# Altium project BW1098OBC_R2M0E2.PrjPcb (part 3 of 3)

## Sheet BW1098OBC_LEFT_OV9282.SchDoc: =project_title
size Tabloid; PageSetup: Record=PageOptions|CenterHorizontal=True|CenterVertical=True|PrintScale=0.71|XCorrection=1.00|YCorrection=1.00|PrintKind=0|BorderSize=5000000|LeftOffset=0|BottomOffset=0|Orientation=2|PaperLength=1000|PaperWidth=1000|Scale=100|PaperSource=7|PrintQuality=-4|MediaType=1|DitherType=10|PrintScaleMode=1|PaperKind=A4; CompanyName: Luxonis Holding; DrawnBy: Brian Weinstein; Organization: Luxonis Holding; Address1: 1925 Harmony Park Drive; Address2: Westminster, CO; Address3: 80234; Address4: United States; DocumentNumber: DXXXX; Revision: R2M0E2; SheetNumber: 4; SheetTotal: 8
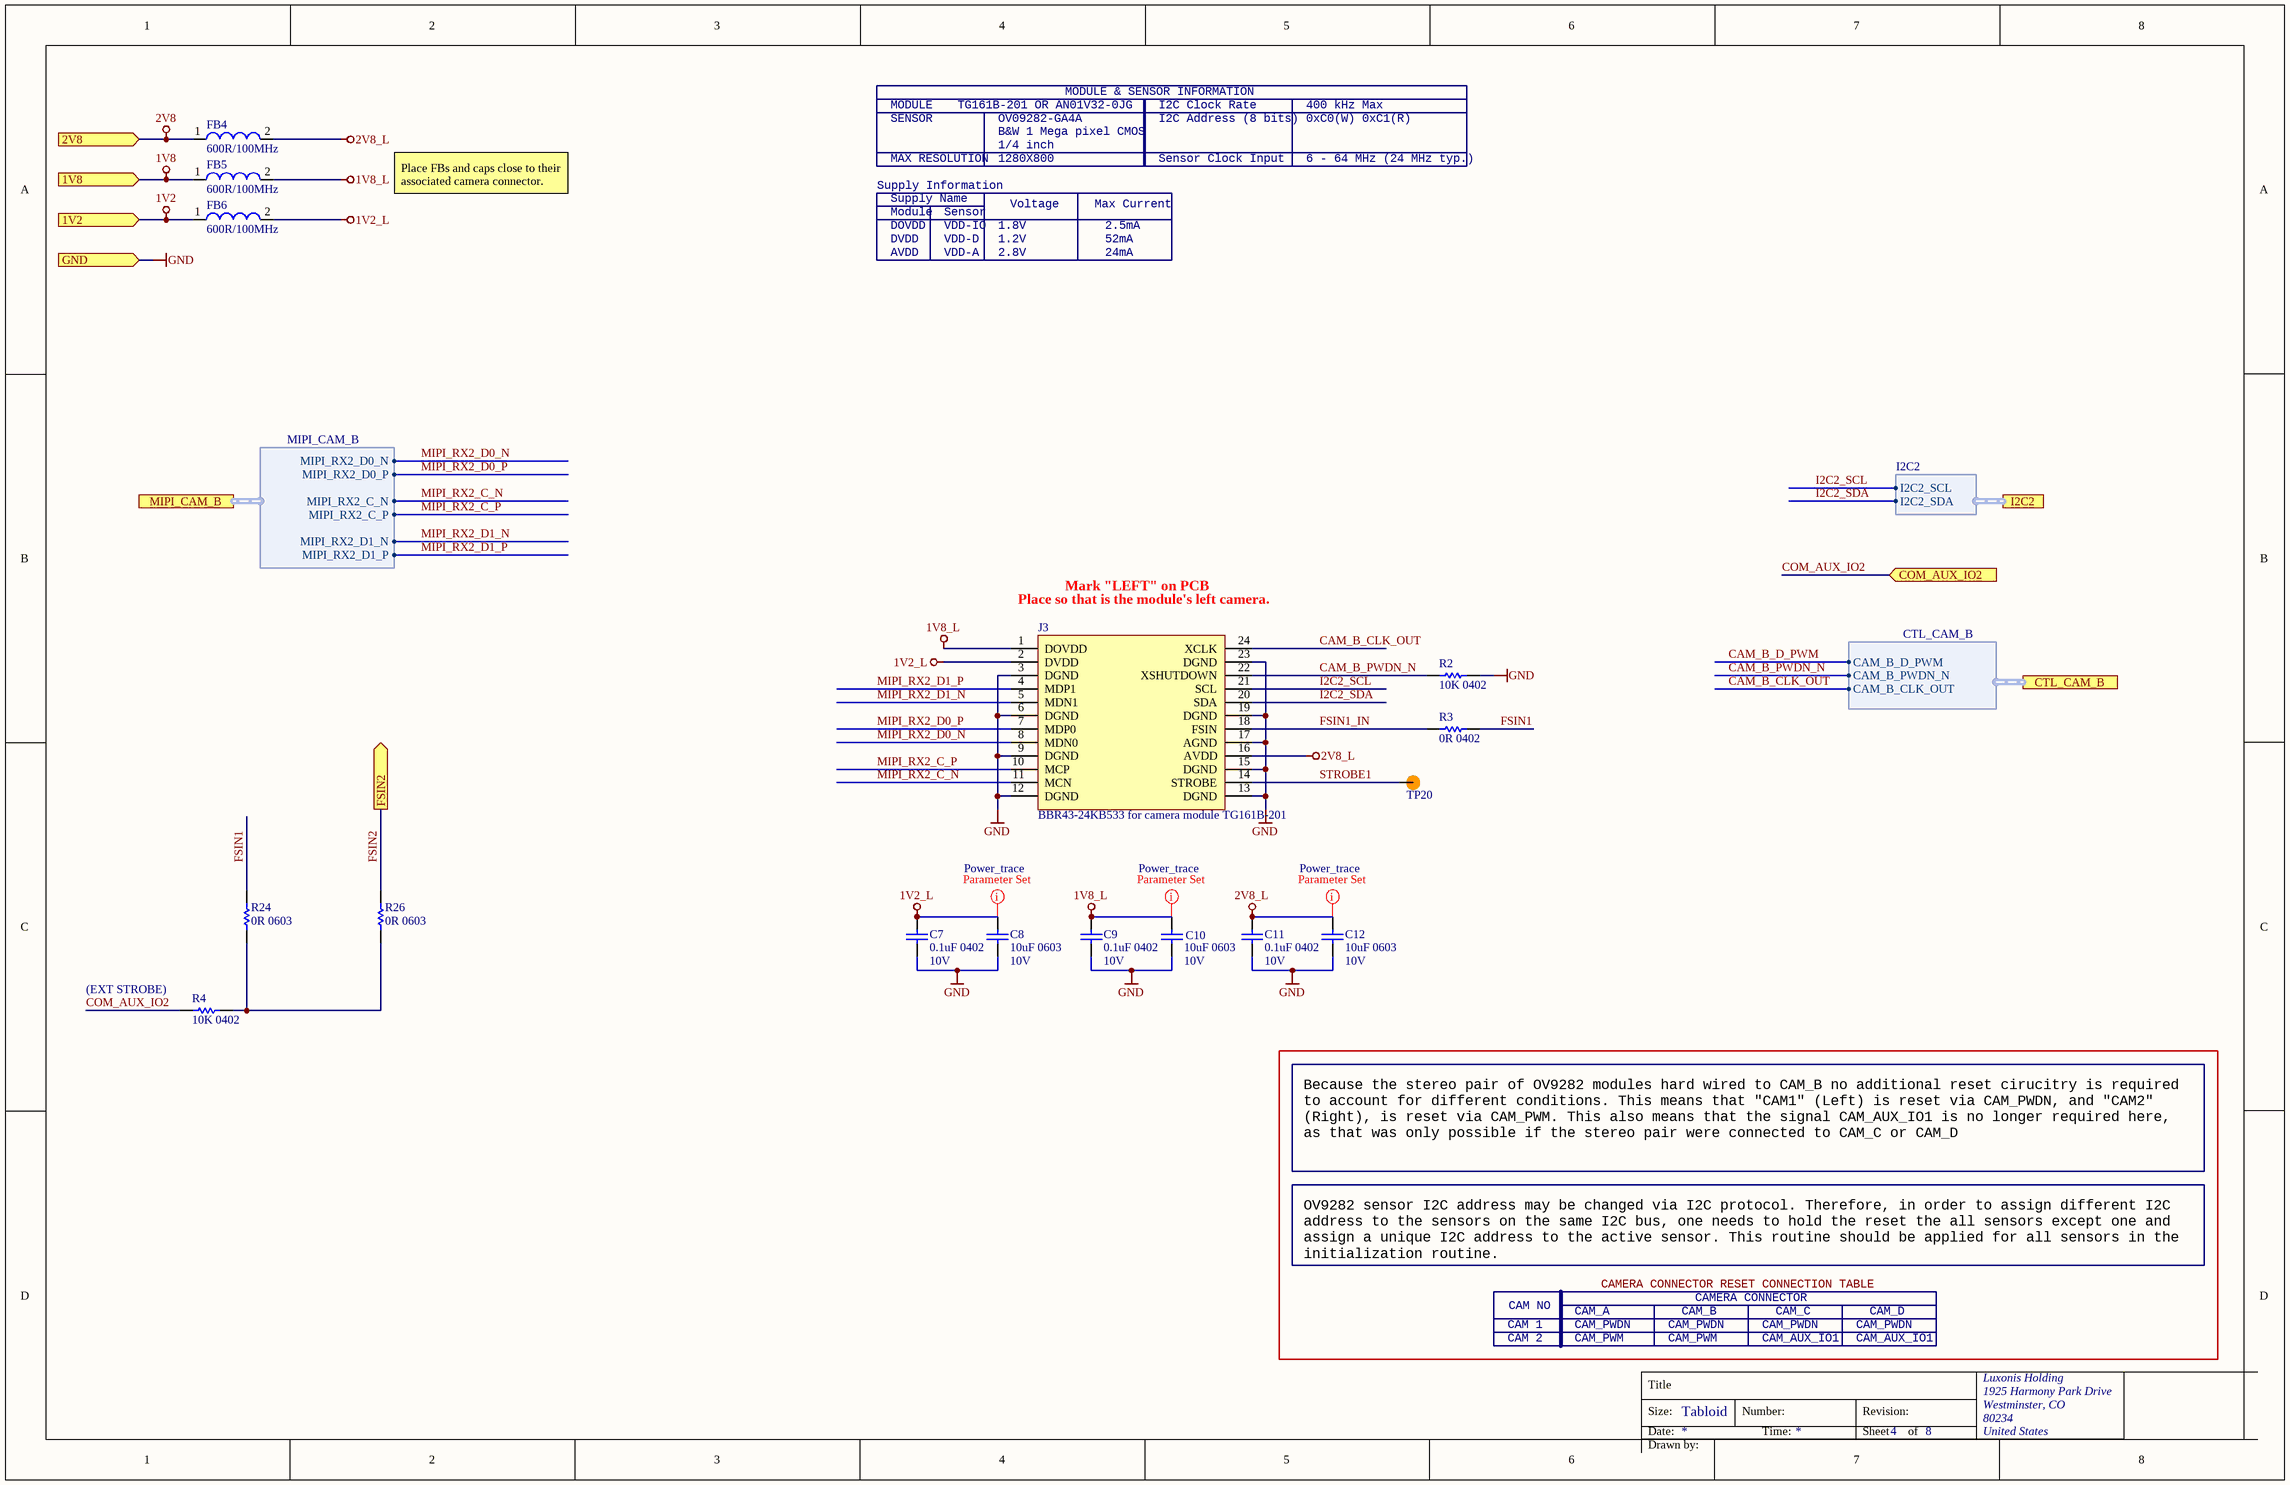
[diagram p5: BW1098OBC_LEFT_OV9282.SchDoc]

### Parts
C7  0.1uF 0402  Voltage Rating: 10V  [CAPC0402(1005)70_L]
C8  10uF 0603  Voltage Rating: 10V  [CAPC0603(1608)100_L]
C9  0.1uF 0402  Voltage Rating: 10V  [CAPC0402(1005)70_L]
C10  10uF 0603  Voltage Rating: 10V  [CAPC0603(1608)100_L]
C11  0.1uF 0402  Voltage Rating: 10V  [CAPC0402(1005)70_L]
C12  10uF 0603  Voltage Rating: 10V  [CAPC0603(1608)100_L]
FB4  600R/100MHz  [2508056017Y2]
FB5  600R/100MHz  [2508056017Y2]
FB6  600R/100MHz  [2508056017Y2]
J3  BBR43-24KB533 for camera module TG161B-201  [TG161B-201 / AN01V32 - Board Wrap (7mm setback) MinPads]
R2  10K 0402  [RESC0402(1005)_L]
R3  0R 0402  [RESC0402(1005)_L]
R4  10K 0402  [RESC0402(1005)_L]
R24  0R 0603  [RESC0603(1608)_N]
R26  0R 0603  [RESC0603(1608)_N]
TP20  TP100_200_NS  [TP100_200_NS]  (value not drawn)  (no BOM)

### Ports
1V2 (in), 1V8 (in), 2V8 (in), COM_AUX_IO2 (in), CTL_CAM_B (harness CTL_CAM_B), FSIN2 (out), GND (in), I2C2 (harness I2C2), MIPI_CAM_B (harness MIPI_CAM_B)

### Harnesses
I2C2: I2C2_SDA, I2C2_SCL
MIPI_CAM_B: MIPI_RX2_D1_P, MIPI_RX2_D1_N, MIPI_RX2_D0_N, MIPI_RX2_D0_P, MIPI_RX2_C_N, MIPI_RX2_C_P
CTL_CAM_B: CAM_B_CLK_OUT, CAM_B_PWDN_N, CAM_B_D_PWM

### Nets
1V2: FB6.1 ; port 1V2
1V2_L: C7.2 C8.2 FB6.2 J3.2(DVDD)
1V8: FB5.1 ; port 1V8
1V8_L: C9.2 C10.2 FB5.2 J3.1(DOVDD)
2V8: FB4.1 ; port 2V8
2V8_L: C11.2 C12.2 FB4.2 J3.16(AVDD)
GND: C7.1 C8.1 C9.1 C10.1 C11.1 C12.1 J3.3(DGND) J3.6(DGND) J3.9(DGND) J3.12(DGND) J3.13(DGND) J3.15(DGND) J3.17(AGND) J3.19(DGND) J3.23(DGND) R2.2 ; port GND
CAM_B_CLK_OUT: J3.24(XCLK) ; port CTL_CAM_B.CAM_B_CLK_OUT
CAM_B_PWDN_N: J3.22(XSHUTDOWN) R2.1 ; port CTL_CAM_B.CAM_B_PWDN_N
COM_AUX_IO2: R4.1 ; port COM_AUX_IO2
FSIN1: R3.2 R24.2
FSIN1_IN: J3.18(FSIN) R3.1
FSIN2: R26.2 ; port FSIN2
I2C2_SCL: J3.21(SCL) ; port I2C2.I2C2_SCL
I2C2_SDA: J3.20(SDA) ; port I2C2.I2C2_SDA
MIPI_RX2_C_N: J3.11(MCN) ; port MIPI_CAM_B.MIPI_RX2_C_N
MIPI_RX2_C_P: J3.10(MCP) ; port MIPI_CAM_B.MIPI_RX2_C_P
MIPI_RX2_D0_N: J3.8(MDN0) ; port MIPI_CAM_B.MIPI_RX2_D0_N
MIPI_RX2_D0_P: J3.7(MDP0) ; port MIPI_CAM_B.MIPI_RX2_D0_P
MIPI_RX2_D1_N: J3.5(MDN1) ; port MIPI_CAM_B.MIPI_RX2_D1_N
MIPI_RX2_D1_P: J3.4(MDP1) ; port MIPI_CAM_B.MIPI_RX2_D1_P
STROBE1: J3.14(STROBE) TP20.1
NetR4_2: R4.2 R24.1 R26.1

### Layout directives
net class Power_trace: 1V2_L, 1V8_L, 2V8_L

### Notes on the sheet
- MODULE & SENSOR INFORMATION
- SENSOR
- MODULE
- MAX RESOLUTION
- TG161B-201 OR AN01V32-0JG
- B&W 1 Mega pixel CMOS
- 1280X800
- OV09282-GA4A
- 1/4 inch
- I2C Address (8 bits)
- I2C Clock Rate
- Sensor Clock Input
- 400 kHz Max
- 6 - 64 MHz (24 MHz typ.)
- 0xC0(W) 0xC1(R)
- Place FBs and caps close to their associated camera connector.
- Supply Information
- DOVDD
- Supply Name
- Module
- VDD-IO
- Sensor
- 1.8V
- Voltage
- Max Current
- 2.5mA
- AVDD
- DVDD
- VDD-A
- VDD-D
- 2.8V
- 1.2V
- 24mA
- 52mA
- (near J3) Place so that is the module's left camera.
- Mark "LEFT" on PCB
- (near R4) (EXT STROBE)
- Because the stereo pair of OV9282 modules hard wired to CAM_B no additional reset cirucitry is required to account for different conditions. This means that "CAM1" (Left) is reset via CAM_PWDN, and "CAM2" (Right), is reset via CAM_PWM. This also means that the signal CAM_AUX_IO1 is no longer required here, as that was only possible if the stereo pair were connected to CAM_C or CAM_D
- OV9282 sensor I2C address may be changed via I2C protocol. Therefore, in order to assign different I2C address to the sensors on the same I2C bus, one needs to hold the reset the all sensors except one and assign a unique I2C address to the active sensor. This routine should be applied for all sensors in the initialization routine.
- CAMERA CONNECTOR RESET CONNECTION TABLE
- CAMERA CONNECTOR
- CAM 1
- CAM 2
- CAM NO
- CAM_A
- CAM_PWDN
- CAM_PWM
- CAM_B
- CAM_AUX_IO1
- CAM_C
- CAM_D
- Title
- Size:
- Date:
- Tabloid
- Number:
- Time:
- Revision:
- Sheet
- of
- Drawn by:

### Library data of the parts
C7 C9 C11 = GRM155R71A104JA01D: CAP CER 0.1UF 10V X7R 0402 5%; Manufacturer 1: Murata; Capacitance: 100nF; Supplier 1: Digi-Key; Manufacturer Part Number 1: GRM155R71A104JA01D; Stock 1: 1346709; Pricing 1: 1=0.10000, 10=0.02500, 100=0.01130, 500=0.00806, 1000=0.00633, 2500=0.00575, 5000=0.00529 (USD); RoHS: Yes; Mount: Surface Mount; Case/Package: 0402; Case Code (Imperial): 0402; Case Code (Metric): 1005; Min Operating Temperature: -55°C; Max Operating Temperature: 125°C; Tolerance: 5%; Packaging: Tape and Reel; Voltage Rating (DC): 10V; Dielectric: X7R; Package Quantity: 10000; Termination: SMD/SMT; Length: 1mm; Height: 0.5mm; Width: 0.02inch; Thickness: 0.022inch; Depth: 0.5mm; Radiation Hardening: No; Lead Free: Lead Free; ComponentLink1URL: https://datasheet.ciiva.com/5411/product-5411135.pdf?src-supplier=Mouser; ComponentLink1Description: https://datasheet.ciiva.com/5411/product-5411135.pdf?src-supplier=Mouser; ComponentLink2URL: https://datasheet.ciiva.com/11618/c02e-11618821.pdf?src-supplier=Avnet; ComponentLink2Description: https://datasheet.ciiva.com/11618/c02e-11618821.pdf?src-supplier=Avnet; Supplier Part Number 1: 490-10777-1-ND
C8 C10 C12 = GRM188R61A106ME69D: CAP CER 10UF 10V X5R 0603 20%; Manufacturer 1: Murata; Material: Ceramic; Supplier 1: Digi-Key; Manufacturer Part Number 1: GRM188R61A106ME69D; Stock 1: 2873098; Pricing 1: 1=0.21000, 10=0.14100, 100=0.07130, 500=0.04876, 1000=0.04313 (USD); RoHS: Yes; Mount: Surface Mount; Case/Package: 0603; Weight: 0.000222oz; Case Code (Metric): 1608; Case Code (Imperial): 0603; Min Operating Temperature: -55°C; Max Operating Temperature: 85°C; Packaging: Tape and Reel; Tolerance: 20%; Capacitance: 10uF; Dielectric: X5R; Voltage Rating (DC): 10V; Package Quantity: 4000; Termination: SMD/SMT; Length: 1.6mm; Height: 0.8mm; Width: 0.8mm; Thickness: 0.035inch; Depth: 0.8mm; REACH SVHC: Unknown; Lead Free: Lead Free; ComponentLink1URL: http://www.mouser.com/ds/2/281/c02e-2905.pdf?src-supplier=Mouser; ComponentLink1Description: http://www.mouser.com/ds/2/281/c02e-2905.pdf?src-supplier=Mouser; ComponentLink2URL: http://components.arrow.com/part/dataview/0323_06119472?src-supplier=Arrow+Europe; ComponentLink2Description: http://components.arrow.com/part/dataview/0323_06119472?src-supplier=Arrow+Europe; ComponentLink3URL: http://www.farnell.com/datasheets/2048014.pdf?src-supplier=Farnell; ComponentLink3Description: http://www.farnell.com/datasheets/2048014.pdf?src-supplier=Farnell; ComponentLink4URL: http://www.farnell.com/datasheets/1872210.pdf?src-supplier=Farnell; ComponentLink4Description: http://www.farnell.com/datasheets/1872210.pdf?src-supplier=Farnell; ComponentLink5URL: http://search.murata.co.jp/Ceramy/image/img/A01X/G101/ENG/GRM188R61A106ME69-01.pdf?src-supplier=Digi-Key; ComponentLink5Description: http://search.murata.co.jp/Ceramy/image/img/A01X/G101/ENG/GRM188R61A106ME69-01.pdf?src-supplier=Digi-Key; ComponentLink6URL: http://www.farnell.com/datasheets/1872210.pdf?src-supplier=Newark; ComponentLink6Description: http://www.farnell.com/datasheets/1872210.pdf?src-supplier=Newark; ComponentLink7URL: http://www.farnell.com/datasheets/2048014.pdf?src-supplier=Element14; ComponentLink7Description: http://www.farnell.com/datasheets/2048014.pdf?src-supplier=Element14; ComponentLink8URL: http://www.farnell.com/datasheets/2048014.pdf?src-supplier=Newark; ComponentLink8Description: http://www.farnell.com/datasheets/2048014.pdf?src-supplier=Newark; Supplier Part Number 1: 490-10475-1-ND
FB4-FB6 = 2508056017Y2: FERRITE BEAD, 0.1OHM, 2A, 0805, 600R/100MHz; Manufacturer 1: Fair-Rite; Impedance: 600R; Tolerance: 25%; Resistance: 350mR; DC Resistance (DCR): 100mR; Test Frequency: 100MHz; Supplier 1: Digi-Key; Manufacturer Part Number 1: 2508056017Y2; Stock 1: 100491; Pricing 1: 1=0.10000, 10=0.07900, 25=0.07120, 50=0.05240, 100=0.04520, 250=0.03568, 500=0.03014, 1000=0.02538 (USD); RoHS: Yes; Case/Package: 0805; Number of Pins: 2; Case Code (Metric): 2012; Case Code (Imperial): 0805; Min Operating Temperature: -55°C; Max Operating Temperature: 125°C; Package Quantity: 4000; Packaging: Tape and Reel; Max DC Current: 2A; Termination: SMD/SMT; Military Standard: Not; DC Current: 2A; Current Rating: 2A; Frequency: 100MHz; Length: 2mm; Height: 0.9mm; Width: 1.25mm; Depth: 1.25mm; Radiation Hardening: No; REACH SVHC: No SVHC; ComponentLink1URL: https://datasheet.ciiva.com/3854/3802508056017y2-3854245.pdf?src-supplier=Arrow; ComponentLink1Description: https://datasheet.ciiva.com/3854/3802508056017y2-3854245.pdf?src-supplier=Arrow; ComponentLink2URL: https://datasheet.ciiva.com/22735/652149-22735047.pdf?src-supplier=Element14; ComponentLink2Description: https://datasheet.ciiva.com/22735/652149-22735047.pdf?src-supplier=Element14; ComponentLink3URL: https://datasheet.ciiva.com/1127/26143-1127514.pdf?src-supplier=Farnell; ComponentLink3Description: https://datasheet.ciiva.com/1127/26143-1127514.pdf?src-supplier=Farnell; ComponentLink4URL: https://datasheet.ciiva.com/18090/getdatasheetpartid-212640-18090187.pdf?src-supplier=Verical; ComponentLink4Description: https://datasheet.ciiva.com/18090/getdatasheetpartid-212640-18090187.pdf?src-supplier=Verical; ComponentLink5URL: https://datasheet.ciiva.com/7620/26143-7620140.pdf?src-supplier=Element14; ComponentLink5Description: https://datasheet.ciiva.com/7620/26143-7620140.pdf?src-supplier=Element14; Supplier Part Number 1: 1934-1487-1-ND
J3 = TG161B-201_Connector: CONN 24 way, 2 row board to board connector SMD; Manufacturer: ACON; Manufacturer PN: BBR43-24KB533
R2 R4 = RC0402FR-1310KL: RES SMD 10K OHM 1% 0402 1/16W Chip Resistor, 0402 [1005 Metric], 10 kohm, RC Series, 50 V, Thick Film, 62.5 mW; Manufacturer 1: Yageo; Resistance: 10kR; Temperature Coefficient: 100ppm/°C; Power Rating: 62.5mW; Voltage Rating: 50V; ComponentLink1URL: https://datasheet.ciiva.com/16940/pyu-rc0402-51-rohs-l-6-16940293.pdf?src-supplier=Avnet+Europe; ComponentLink1Description: https://datasheet.ciiva.com/16940/pyu-rc0402-51-rohs-l-6-16940293.pdf?src-supplier=Avnet+Europe; ComponentLink2URL: https://datasheet.ciiva.com/28386/pyu-rc0402-51-rohs-l-6-28386855.pdf?src-supplier=Avnet+Europe; ComponentLink2Description: https://datasheet.ciiva.com/28386/pyu-rc0402-51-rohs-l-6-28386855.pdf?src-supplier=Avnet+Europe; ComponentLink3URL: https://datasheet.ciiva.com/16740/pyu-rc0402-51-rohs-l-6-r-16740602.pdf?src-supplier=Future+Electronics; ComponentLink3Description: https://datasheet.ciiva.com/16740/pyu-rc0402-51-rohs-l-6-r-16740602.pdf?src-supplier=Future+Electronics; ComponentLink4URL: https://datasheet.ciiva.com/8891/pyu-rc0402-51-rohs-l-6-8891339.pdf?src-supplier=Avnet; ComponentLink4Description: https://datasheet.ciiva.com/8891/pyu-rc0402-51-rohs-l-6-8891339.pdf?src-supplier=Avnet; ComponentLink5URL: https://datasheet.ciiva.com/5557/pyu-rc0402-51-rohs-l-6-r-5557997.pdf?src-supplier=Mouser; ComponentLink5Description: https://datasheet.ciiva.com/5557/pyu-rc0402-51-rohs-l-6-r-5557997.pdf?src-supplier=Mouser; ComponentLink6URL: https://datasheet.ciiva.com/7983/1018594-7983533.pdf?src-supplier=Element14; ComponentLink6Description: https://datasheet.ciiva.com/7983/1018594-7983533.pdf?src-supplier=Element14; Supplier 1: Newark; Manufacturer Part Number 1: RC0402FR-1310KL; Stock 1: 62239; Pricing 1: 1=0.10000, 25=0.01200, 100=0.00400, 250=0.00400, 500=0.00300, 1000=0.00300 (USD); RoHS: Yes; Case/Package: 0402; Number of Pins: 2; Contact Plating: Tin,Matte,Lead; Case Code (Imperial): 0402; Case Code (Metric): 1005; Min Operating Temperature: -55°C; Max Operating Temperature: 155°C; Tolerance: 1%; Composition: Thick Film; Packaging: Tape and Reel; Termination: SMD/SMT; Military Standard: Not; Voltage Rating (DC): 50V; Working Voltage: 50V; Number of Terminations: 2; Length: 1mm; Depth: 0.5mm; Radiation Hardening: No; REACH SVHC: No SVHC; Lead Free: Lead Free; Supplier Part Number 1: 67R9960
R3 = CRCW04020000Z0ED: RES SMD 0 OHM JUMPER 1/16W 0402; Manufacturer 1: Vishay; Resistance: 0mR; Power Rating: 63mW; Voltage Rating: 50V; Temperature Coefficient: 100ppm/°C; Tolerance: 5%; Supplier 1: Digi-Key; Manufacturer Part Number 1: CRCW04020000Z0ED; Stock 1: 855968; Pricing 1: 1=0.10000, 10=0.03400, 25=0.02440, 50=0.01860, 100=0.01380, 250=0.01048, 500=0.00840, 1000=0.00618, 5000=0.00443 (USD); RoHS: Yes; Mount: Surface Mount; Case/Package: 0402; Weight: 2.3E-05oz; Case Code (Imperial): 0402; Case Code (Metric): 1005; Contact Plating: Tin; Min Operating Temperature: -55°C; Max Operating Temperature: 155°C; Packaging: Tape and Reel; Composition: Thick Film; Voltage Rating (DC): 50V; Package Quantity: 1; Termination: SMD/SMT; Number of Terminations: 2; Military Standard: Not; Max Power Dissipation: 63mW; Features: Automotive AEC-Q200; Length: 1mm; Height: 0.35mm; Width: 0.5mm; Depth: 0.5mm; Radiation Hardening: No; REACH SVHC: Unknown; Lead Free: Lead Free; ComponentLink1URL: https://datasheet.ciiva.com/3255/dcrcwe3-3255944.pdf?src-supplier=Avnet; ComponentLink1Description: https://datasheet.ciiva.com/3255/dcrcwe3-3255944.pdf?src-supplier=Avnet; ComponentLink2URL: https://datasheet.ciiva.com/3255/dcrcwe3-3255945.pdf?src-supplier=Avnet; ComponentLink2Description: https://datasheet.ciiva.com/3255/dcrcwe3-3255945.pdf?src-supplier=Avnet; ComponentLink3URL: https://datasheet.ciiva.com/16881/dcrcwe3-16881413.pdf?src-supplier=Avnet+Europe; ComponentLink3Description: https://datasheet.ciiva.com/16881/dcrcwe3-16881413.pdf?src-supplier=Avnet+Europe; ComponentLink4URL: https://datasheet.ciiva.com/2461/dcrcwe3-2461962.pdf?src-supplier=Digi-Key; ComponentLink4Description: https://datasheet.ciiva.com/2461/dcrcwe3-2461962.pdf?src-supplier=Digi-Key; ComponentLink5URL: https://datasheet.ciiva.com/7841/1720486-7841802.pdf?src-supplier=Element14; ComponentLink5Description: https://datasheet.ciiva.com/7841/1720486-7841802.pdf?src-supplier=Element14; ComponentLink6URL: https://datasheet.ciiva.com/2461/dcrcwe3-2461963.pdf?src-supplier=Digi-Key; ComponentLink6Description: https://datasheet.ciiva.com/2461/dcrcwe3-2461963.pdf?src-supplier=Digi-Key; ComponentLink7URL: https://datasheet.ciiva.com/2461/dcrcwe3-2461964.pdf?src-supplier=Digi-Key; ComponentLink7Description: https://datasheet.ciiva.com/2461/dcrcwe3-2461964.pdf?src-supplier=Digi-Key; ComponentLink8URL: https://datasheet.ciiva.com/7841/1697337-7841468.pdf?src-supplier=Element14; ComponentLink8Description: https://datasheet.ciiva.com/7841/1697337-7841468.pdf?src-supplier=Element14; ComponentLink9URL: https://datasheet.ciiva.com/16761/70200976-16761309.pdf?src-supplier=Allied+Electronics; ComponentLink9Description: https://datasheet.ciiva.com/16761/70200976-16761309.pdf?src-supplier=Allied+Electronics; ComponentLink10URL: https://datasheet.ciiva.com/26311/fld-crcw-e3-data-en-26311550.pdf?src-supplier=Distrelec; ComponentLink10Description: https://datasheet.ciiva.com/26311/fld-crcw-e3-data-en-26311550.pdf?src-supplier=Distrelec; Supplier Part Number 1: 541-0.0JCT-ND
R24 R26 = CRCW06030000Z0EA: RES SMD 0 OHM JUMPER 1/10W 0603 0 Ohms Jumper 0.1W, 1/10W Chip Resistor 0603 (1608 Metric) Automotive AEC-Q200 Thick Film; Manufacturer 1: Vishay; Manufacturer Part Number 1: CRCW0603-0000Z0EA; Resistance: 0mR; Power Rating: 100mW; Voltage Rating: 75V; Temperature Coefficient: 100ppm/°C; Tolerance: 5%; Current Rating: 2A; Supplier 1: Digi-Key; Stock 1: 742743; Pricing 1: 1=0.100000, 10=0.034000, 25=0.024400, 50=0.018600, 100=0.013800, 250=0.010480, 500=0.008400, 1000=0.006180 (USD); RoHS: Yes; Mount: Surface Mount; Case/Package: 0603; Weight: 7.1E-05oz; Contact Plating: Tin,Lead; Case Code (Metric): 1608; Case Code (Imperial): 0603; Min Operating Temperature: -55°C; Max Operating Temperature: 155°C; Composition: Thick Film; Termination: SMD/SMT; Packaging: Tape and Reel; Package Quantity: 1; Number of Terminations: 2; Military Standard: Not; Max Power Dissipation: 100mW; Voltage Rating (DC): 75V; Features: Automotive AEC-Q200; Working Voltage: 75V; Length: 1.55mm; Height: 0.02inch; Width: 0.033inch; Depth: 0.85mm; Radiation Hardening: No; Lead Free: Lead Free; REACH SVHC: Unknown; ComponentLink1URL: https://datasheet.ciiva.com/2461/dcrcwe3-2461968.pdf?src-supplier=Digi-Key; ComponentLink1Description: https://datasheet.ciiva.com/2461/dcrcwe3-2461968.pdf?src-supplier=Digi-Key; ComponentLink2URL: https://datasheet.ciiva.com/2461/dcrcwe3-2461969.pdf?src-supplier=Digi-Key; ComponentLink2Description: https://datasheet.ciiva.com/2461/dcrcwe3-2461969.pdf?src-supplier=Digi-Key; ComponentLink3URL: https://datasheet.ciiva.com/2461/dcrcwe3-2461970.pdf?src-supplier=Digi-Key; ComponentLink3Description: https://datasheet.ciiva.com/2461/dcrcwe3-2461970.pdf?src-supplier=Digi-Key; ComponentLink4URL: https://datasheet.ciiva.com/8340/dcrcwe3-8340197.pdf?src-supplier=Avnet; ComponentLink4Description: https://datasheet.ciiva.com/8340/dcrcwe3-8340197.pdf?src-supplier=Avnet; ComponentLink5URL: https://datasheet.ciiva.com/16941/dcrcw-16941302.pdf?src-supplier=Avnet+Europe; ComponentLink5Description: https://datasheet.ciiva.com/16941/dcrcw-16941302.pdf?src-supplier=Avnet+Europe; ComponentLink6URL: https://datasheet.ciiva.com/16199/dcrcwe3-16199063.pdf?src-supplier=Future+Electronics; ComponentLink6Description: https://datasheet.ciiva.com/16199/dcrcwe3-16199063.pdf?src-supplier=Future+Electronics; ComponentLink7URL: https://datasheet.ciiva.com/16725/70201119-16725175.pdf?src-supplier=Allied+Electronics; ComponentLink7Description: https://datasheet.ciiva.com/16725/70201119-16725175.pdf?src-supplier=Allied+Electronics; ComponentLink8URL: https://datasheet.ciiva.com/26316/fld-crcw-e3-data-en-26316615.pdf?src-supplier=Distrelec; ComponentLink8Description: https://datasheet.ciiva.com/26316/fld-crcw-e3-data-en-26316615.pdf?src-supplier=Distrelec; ComponentLink9URL: https://datasheet.ciiva.com/5544/dcrcwe3-109170-5544344.pdf?src-supplier=Mouser; ComponentLink9Description: https://datasheet.ciiva.com/5544/dcrcwe3-109170-5544344.pdf?src-supplier=Mouser; ComponentLink10URL: https://datasheet.ciiva.com/7841/1720486-7841816.pdf?src-supplier=Element14; ComponentLink10Description: https://datasheet.ciiva.com/7841/1720486-7841816.pdf?src-supplier=Element14; ComponentLink11URL: https://datasheet.ciiva.com/7841/1720486-7841817.pdf?src-supplier=Element14; ComponentLink11Description: https://datasheet.ciiva.com/7841/1720486-7841817.pdf?src-supplier=Element14; ComponentLink12URL: https://datasheet.ciiva.com/7841/125364-7841818.pdf?src-supplier=Element14; ComponentLink12Description: https://datasheet.ciiva.com/7841/125364-7841818.pdf?src-supplier=Element14; ComponentLink13URL: https://datasheet.ciiva.com/16721/70201119-16721450.pdf?src-supplier=Allied+Electronics; ComponentLink13Description: https://datasheet.ciiva.com/16721/70201119-16721450.pdf?src-supplier=Allied+Electronics; Supplier Part Number 1: 541-0.0GCT-ND
TP20 = TEST_POINT

## Sheet BW1098OBC_USB.SchDoc: =project_title
size Tabloid; PageSetup: Record=PageOptions|CenterHorizontal=True|CenterVertical=True|PrintScale=0.73|XCorrection=1.00|YCorrection=1.00|PrintKind=0|BorderSize=5000000|LeftOffset=0|BottomOffset=0|Orientation=2|PaperLength=1000|PaperWidth=1000|Scale=100|PaperSource=7|PrintQuality=-4|MediaType=1|DitherType=10|PaperKind=A4|PrintScaleMode=1; CompanyName: Luxonis Holding; DrawnBy: Brian Weinstein; Organization: Luxonis Holding; Address1: 1925 Harmony Park Drive; Address2: Westminster, CO; Address3: 80234; Address4: United States; DocumentNumber: DXXXX; Revision: R2M0E2; SheetNumber: 8; SheetTotal: 8
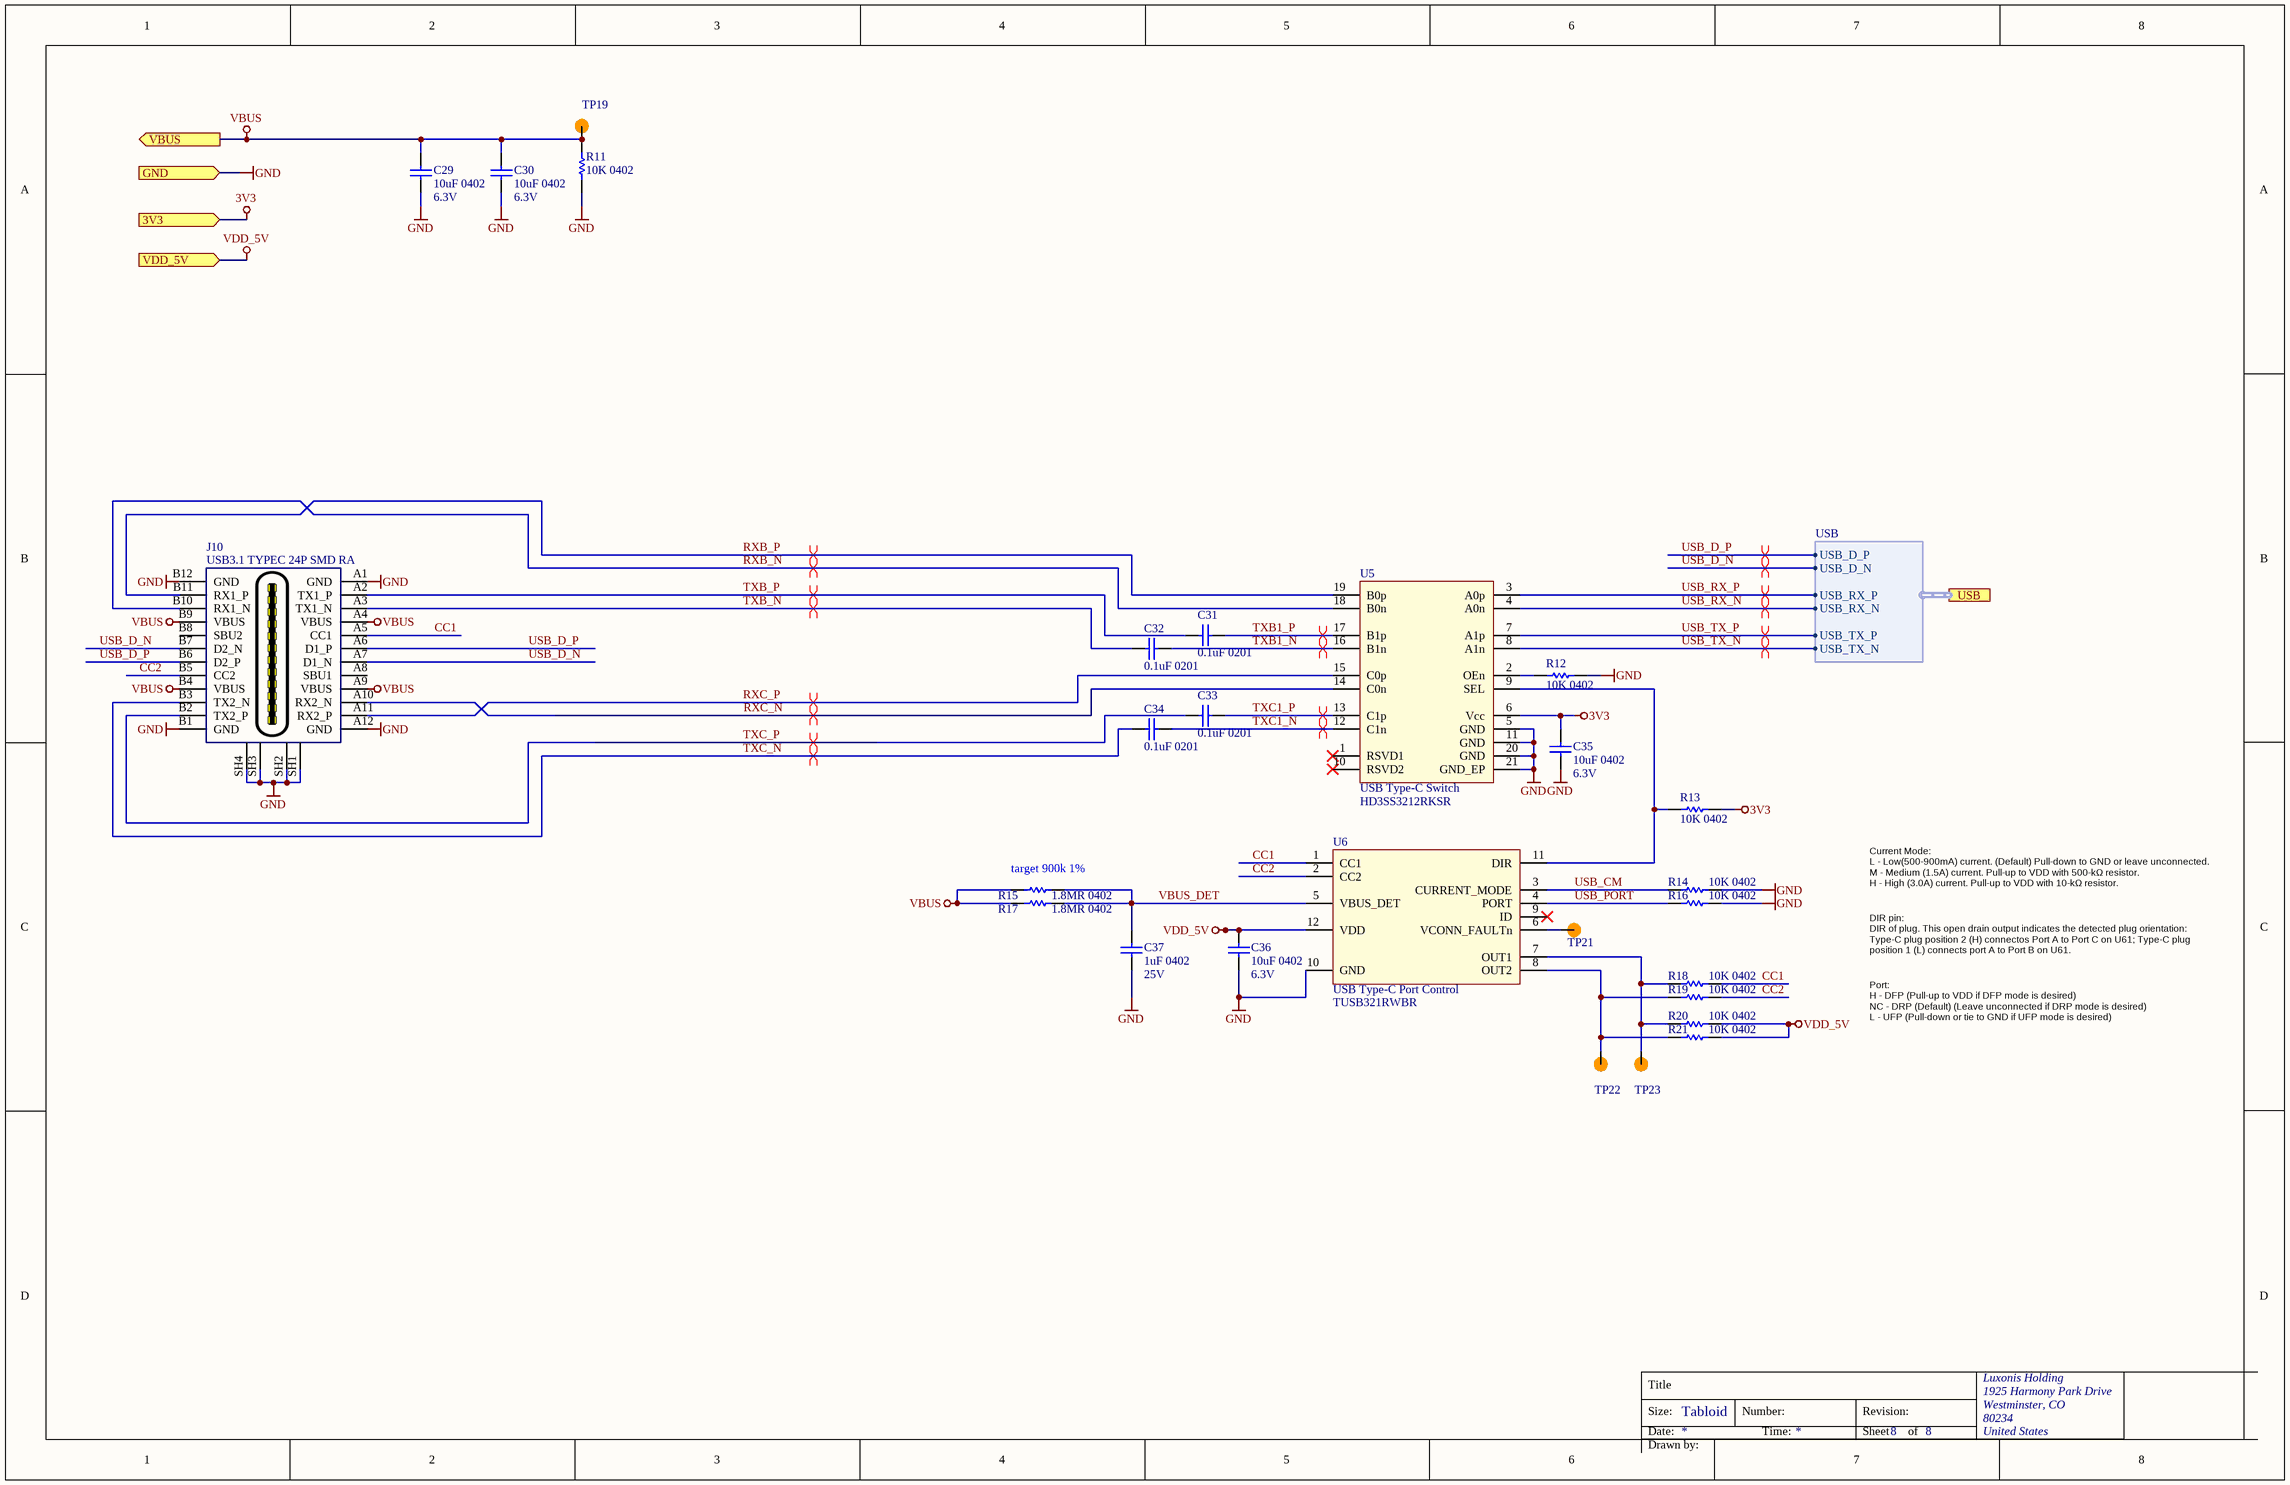
[diagram p6: BW1098OBC_USB.SchDoc]

### Parts
C29  10uF 0402  Voltage Rating: 6.3V  [CAPC0402(1005)70_L]
C30  10uF 0402  Voltage Rating: 6.3V  [CAPC0402(1005)70_L]
C31  0.1uF 0201  [CAPC0201(0603)33_L]
C32  0.1uF 0201  [CAPC0201(0603)33_L]
C33  0.1uF 0201  [CAPC0201(0603)33_L]
C34  0.1uF 0201  [CAPC0201(0603)33_L]
C35  10uF 0402  Voltage Rating: 6.3V  [CAPC0402(1005)70_L]
C36  10uF 0402  Voltage Rating: 6.3V  [CAPC0402(1005)70_L]
C37  1uF 0402  Voltage Rating: 25V  [CAPC0402(1005)70_N]
J10  USB3.1 TYPEC 24P SMD RA  [105450-0101]
R11  10K 0402  [RESC0402(1005)_L]
R12  10K 0402  [RESC0402(1005)_L]
R13  10K 0402  [RESC0402(1005)_L]
R14  10K 0402  [RESC0402(1005)_L]
R15  1.8MR 0402  [RESC0402(1005)_L]
R16  10K 0402  [RESC0402(1005)_L]
R17  1.8MR 0402  [RESC0402(1005)_L]
R18  10K 0402  [RESC0402(1005)_L]
R19  10K 0402  [RESC0402(1005)_L]
R20  10K 0402  [RESC0402(1005)_L]
R21  10K 0402  [RESC0402(1005)_L]
TP19  TP100_200_NS  [TP100_200_NS]  (value not drawn)  (no BOM)
TP21  TP100_200_NS  [TP100_200_NS]  (value not drawn)  (no BOM)
TP22  TP100_200_NS  [TP100_200_NS]  (value not drawn)  (no BOM)
TP23  TP100_200_NS  [TP100_200_NS]  (value not drawn)  (no BOM)
U5  USB Type-C Switch  [HD3SS3212RKSR]
U6  USB Type-C Port Control  [TUSB321RWBR]

### Ports
3V3 (in), GND (in), USB (harness USB), VBUS (out), VDD_5V (in)

### Harnesses
USB: USB_D_P, USB_D_N, USB_TX_N, USB_TX_P, USB_RX_N, USB_RX_P

### Nets
3V3: C35.2 R13.2 U5.6(Vcc) ; port 3V3
GND: C29.1 C30.1 C35.1 C36.1 C37.1 J10.A1(GND) J10.A12(GND) J10.B1(GND) J10.B12(GND) J10.SH1(SH) J10.SH2(SH) J10.SH3(SH) J10.SH4(SH) R11.1 R12.2 R14.2 R16.2 U5.5(GND) U5.11(GND) U5.20(GND) U5.21(GND_EP) U6.10(GND) ; port GND
VBUS: C29.2 C30.2 J10.A4(VBUS) J10.A9(VBUS) J10.B4(VBUS) J10.B9(VBUS) R11.2 R15.1 R17.1 TP19.1 ; port VBUS
VDD_5V: C36.2 R20.2 R21.2 U6.12(VDD) ; port VDD_5V
CC1: J10.A5(CC1) R18.2 U6.1(CC1)
CC2: J10.B5(CC2) R19.2 U6.2(CC2)
RXB_N: J10.B10(RX1_N) U5.18(B0n)
RXB_P: J10.B11(RX1_P) U5.19(B0p)
RXC_N: J10.A10(RX2_N) U5.14(C0n)
RXC_P: J10.A11(RX2_P) U5.15(C0p)
TXB1_N: C32.2 U5.16(B1n)
TXB1_P: C31.2 U5.17(B1p)
TXB_N: C32.1 J10.A3(TX1_N)
TXB_P: C31.1 J10.A2(TX1_P)
TXC1_N: C34.2 U5.12(C1n)
TXC1_P: C33.2 U5.13(C1p)
TXC_N: C34.1 J10.B3(TX2_N)
TXC_P: C33.1 J10.B2(TX2_P)
USB_CM: R14.1 U6.3(CURRENT_MODE)
USB_D_N: J10.A7(D1_N) J10.B7(D2_N) ; port USB.USB_D_N
USB_D_P: J10.A6(D1_P) J10.B6(D2_P) ; port USB.USB_D_P
USB_PORT: R16.1 U6.4(PORT)
USB_RX_N: U5.4(A0n) ; port USB.USB_RX_N
USB_RX_P: U5.3(A0p) ; port USB.USB_RX_P
USB_TX_N: U5.8(A1n) ; port USB.USB_TX_N
USB_TX_P: U5.7(A1p) ; port USB.USB_TX_P
VBUS_DET: C37.2 R15.2 R17.2 U6.5(VBUS_DET)
NetR12_1: R12.1 U5.2(OEn)
NetR13_1: R13.1 U5.9(SEL) U6.11(DIR)
NetR18_1: R18.1 R20.1 TP23.1 U6.7(OUT1)
NetR19_1: R19.1 R21.1 TP22.1 U6.8(OUT2)
NetTP21_1: TP21.1 U6.6(VCONN_FAULTn)

Not connected (* = marked no-connect by the designer): J10 A8(SBU1) B8(SBU2); U5 1(RSVD1)* 10(RSVD2)*; U6 9(ID)*

### Layout directives
differential pair; differential pair class USB3: RXB_N, RXB_P, RXC_N, RXC_P, TXB1_N, TXB1_P, TXB_N, TXB_P, TXC1_N, TXC1_P, TXC_N, TXC_P, USB_D_N, USB_D_P, USB_RX_N, USB_RX_P, USB_TX_N, USB_TX_P

### Notes on the sheet
- (near R15) target 900k 1%
- Current Mode:
  L - Low(500-900mA) current. (Default) Pull-down to GND or leave unconnected.
  M - Medium (1.5A) current. Pull-up to VDD with 500-kΩ resistor.
  H - High (3.0A) current. Pull-up to VDD with 10-kΩ resistor.
- DIR pin:
  DIR of plug. This open drain output indicates the detected plug orientation: Type-C plug position 2 (H) connectos Port A to Port C on U61; Type-C plug position 1 (L) connects port A to Port B on U61.
- Port:
  H - DFP (Pull-up to VDD if DFP mode is desired)
  NC - DRP (Default) (Leave unconnected if DRP mode is desired)
  L - UFP (Pull-down or tie to GND if UFP mode is desired)
- Title
- Size:
- Date:
- Tabloid
- Number:
- Time:
- Revision:
- Sheet
- of
- Drawn by:

### Library data of the parts
C29 C30 C35 C36 = GRM155R60J106ME15D: CAP CER 10UF 6.3V X5R 0402 20%; Manufacturer 1: Murata; Supplier 1: Digi-Key; Manufacturer Part Number 1: GRM155R60J106ME15D; Stock 1: 1839627; Pricing 1: 1=0.23000, 10=0.15700, 100=0.07950, 500=0.05442, 1000=0.04814, 2500=0.04605, 5000=0.04186 (USD); RoHS: Yes; Mount: Surface Mount; Case/Package: 0402; Case Code (Metric): 1005; Case Code (Imperial): 0402; Min Operating Temperature: -55°C; Max Operating Temperature: 85°C; Packaging: Tape and Reel; Capacitance: 10uF; Dielectric: X5R; Length: 0.039inch; Width: 0.02inch; ComponentLink1URL: https://www.murata.com/~/media/webrenewal/support/library/catalog/products/capacitor/mlcc/c02e.ashx?la=en-us&src-supplier=Digi-Key; ComponentLink1Description: https://www.murata.com/~/media/webrenewal/support/library/catalog/products/capacitor/mlcc/c02e.ashx?la=en-us&src-supplier=Digi-Key; Supplier Part Number 1: 490-13238-1-ND; Voltage Rating (DC): 6.3V; Thickness: 0.026inch; Tolerance: 20%
C31-C34 = GRM033R61A104KE15D: CAP CER 0.1UF 10V X5R 0201; Manufacturer 1: Murata; Capacitance: 100nF; Tolerance: 10%; Supplier 1: Digi-Key; Manufacturer Part Number 1: GRM033R61A104KE15D; Stock 1: 45335312; Pricing 1: 1=0.10000, 10=0.04200, 100=0.01860, 500=0.01330, 1000=0.01045, 2500=0.00950, 5000=0.00874 (USD); RoHS: Yes; Mount: Surface Mount; Case/Package: 0201; Weight: 6E-06oz; Case Code (Metric): 0603; Case Code (Imperial): 0201; Min Operating Temperature: -55°C; Max Operating Temperature: 85°C; Packaging: Tape and Reel; Voltage Rating: 10V; Package Quantity: 1; Voltage Rating (DC): 10V; Dielectric: X5R; Termination: SMD/SMT; Length: 0.6mm; Height: 0.3mm; Width: 0.012inch; Thickness: 0.013inch; Depth: 0.3mm; Radiation Hardening: No; Lead Free: Lead Free; REACH SVHC: No SVHC; ComponentLink1URL: https://datasheet.ciiva.com/26843/getdatasheetpartid-308656-26843739.pdf?src-supplier=Verical; ComponentLink1Description: https://datasheet.ciiva.com/26843/getdatasheetpartid-308656-26843739.pdf?src-supplier=Verical; ComponentLink2URL: https://datasheet.ciiva.com/5413/product-5413117.pdf?src-supplier=Mouser; ComponentLink2Description: https://datasheet.ciiva.com/5413/product-5413117.pdf?src-supplier=Mouser; ComponentLink3URL: https://datasheet.ciiva.com/6256/partnumbering-e-01-6256406.pdf?src-supplier=Digi-Key; ComponentLink3Description: https://datasheet.ciiva.com/6256/partnumbering-e-01-6256406.pdf?src-supplier=Digi-Key; ComponentLink4URL: https://datasheet.ciiva.com/6256/partnumbering-e-01-6256407.pdf?src-supplier=Digi-Key; ComponentLink4Description: https://datasheet.ciiva.com/6256/partnumbering-e-01-6256407.pdf?src-supplier=Digi-Key; ComponentLink5URL: https://datasheet.ciiva.com/6256/partnumbering-e-01-6256408.pdf?src-supplier=Digi-Key; ComponentLink5Description: https://datasheet.ciiva.com/6256/partnumbering-e-01-6256408.pdf?src-supplier=Digi-Key; Supplier Part Number 1: 490-5881-1-ND; Voltage: 10V
C37 = GRM155R61E105KA12D: CAP CER 1UF 25V X5R 0402 10%; Manufacturer 1: Murata; Material: Ceramic; Supplier 1: Digi-Key; Manufacturer Part Number 1: GRM155R61E105KA12D; Stock 1: 200653; Pricing 1: 1=0.10000, 10=0.07100, 100=0.03350, 500=0.02352, 1000=0.01947, 2500=0.01812, 5000=0.01658 (USD); RoHS: Yes; Mount: Surface Mount; Case/Package: 0402; Weight: 0.000212oz; Case Code (Metric): 1005; Case Code (Imperial): 0402; Min Operating Temperature: -55°C; Max Operating Temperature: 85°C; Tolerance: 10%; Capacitance: 1uF; Dielectric: X5R; Voltage Rating (DC): 25V; Packaging: Tape and Reel; Package Quantity: 10000; Termination: SMD/SMT; Voltage: 25V; Length: 1mm; Height: 0.5mm; Width: 0.5mm; Thickness: 0.022inch; Depth: 0.5mm; Lead Free: Lead Free; REACH SVHC: No SVHC; ComponentLink1URL: https://datasheet.ciiva.com/22732/1666664-22732122.pdf?src-supplier=Element14; ComponentLink1Description: https://datasheet.ciiva.com/22732/1666664-22732122.pdf?src-supplier=Element14; ComponentLink2URL: https://datasheet.ciiva.com/7719/1666664-7719006.pdf?src-supplier=Element14; ComponentLink2Description: https://datasheet.ciiva.com/7719/1666664-7719006.pdf?src-supplier=Element14; Supplier Part Number 1: 490-10017-1-ND; Supplier 2: Arrow; Supplier 3: TTI; Supplier Part Number 2: GRM155R61E105KA12D; Supplier Part Number 3: GRM155R61E105KA12D
J10 = 105450-0101: CONN RCP USB3.1 TYPEC 24P SMD RA; Manufacturer 1: Molex; Connector Type: USB; Number of Contacts: 24; Gender: Receptacle; Number of Ports: 1; Current Rating: 5A; Mating Cycles: 10000; Shielding: Shielded; Pitch: 0.5mm; Supplier 1: Digi-Key; Manufacturer Part Number 1: 105450-0101; Stock 1: 13882; Pricing 1: 1=2.15000, 10=1.94900, 25=1.82960, 50=1.75000, 100=1.67050, 250=1.51140, 500=1.39208 (USD); RoHS: Yes; Mount: Surface Mount,Through Hole,Horizontal; Case/Package: 0101; Number of Pins: 24; Contact Material: Copper Alloy; Contact Plating: Gold; Number of Terminals: 24; Housing Material: Thermoplastic; Insulation Color: Black; Min Operating Temperature: -30°C; Max Operating Temperature: 85°C; Packaging: Tape and Reel; Orientation: Right Angle; Termination: Solder; USB Standard: USB 3.1; Features: Shielded; Length: 8.94mm; REACH SVHC: Unknown; Flammability Rating: UL94 V-0; ComponentLink1URL: http://www.farnell.com/datasheets/2673427.pdf?src-supplier=Farnell; ComponentLink1Description: http://www.farnell.com/datasheets/2673427.pdf?src-supplier=Farnell; ComponentLink2URL: http://www.farnell.com/datasheets/2801634.pdf?src-supplier=Farnell; ComponentLink2Description: http://www.farnell.com/datasheets/2801634.pdf?src-supplier=Farnell; ComponentLink3URL: http://www.farnell.com/datasheets/2672741.pdf?src-supplier=Newark; ComponentLink3Description: http://www.farnell.com/datasheets/2672741.pdf?src-supplier=Newark; ComponentLink4URL: https://www.molex.com/pdm_docs/sd/1054500101_sd.pdf?src-supplier=Digi-Key; ComponentLink4Description: https://www.molex.com/pdm_docs/sd/1054500101_sd.pdf?src-supplier=Digi-Key; ComponentLink5URL: https://www.molex.com/pdm_docs/ps/PS-105448-001.pdf?src-supplier=Digi-Key; ComponentLink5Description: https://www.molex.com/pdm_docs/ps/PS-105448-001.pdf?src-supplier=Digi-Key; ComponentLink6URL: http://www.farnell.com/datasheets/2015275.pdf?src-supplier=Element14; ComponentLink6Description: http://www.farnell.com/datasheets/2015275.pdf?src-supplier=Element14; ComponentLink7URL: http://www.literature.molex.com/SQLImages/kelmscott/Molex/PDF_Images/987651-4081.PDF?src-supplier=Avnet; ComponentLink7Description: http://www.literature.molex.com/SQLImages/kelmscott/Molex/PDF_Images/987651-4081.PDF?src-supplier=Avnet; ComponentLink8URL: http://www.literature.molex.com/SQLImages/kelmscott/Molex/PDF_Images/987651-4081.PDF?src-supplier=Avnet+Asia; ComponentLink8Description: http://www.literature.molex.com/SQLImages/kelmscott/Molex/PDF_Images/987651-4081.PDF?src-supplier=Avnet+Asia; Supplier Part Number 1: WM12856CT-ND
R11-R14 R16 R18-R21 = RC0402FR-1310KL: as R2 on sheet BW1098OBC_LEFT_OV9282; ComponentLink1URL: https://datasheet.ciiva.com/16940/pyu-rc0402-51-rohs-l-6-16940293.pdf?src-supplier=Avnet+Europe; ComponentLink1Description: https://datasheet.ciiva.com/16940/pyu-rc0402-51-rohs-l-6-16940293.pdf?src-supplier=Avnet+Europe; ComponentLink2URL: https://datasheet.ciiva.com/28386/pyu-rc0402-51-rohs-l-6-28386855.pdf?src-supplier=Avnet+Europe; ComponentLink2Description: https://datasheet.ciiva.com/28386/pyu-rc0402-51-rohs-l-6-28386855.pdf?src-supplier=Avnet+Europe; ComponentLink3URL: https://datasheet.ciiva.com/16740/pyu-rc0402-51-rohs-l-6-r-16740602.pdf?src-supplier=Future+Electronics; ComponentLink3Description: https://datasheet.ciiva.com/16740/pyu-rc0402-51-rohs-l-6-r-16740602.pdf?src-supplier=Future+Electronics; ComponentLink4URL: https://datasheet.ciiva.com/8891/pyu-rc0402-51-rohs-l-6-8891339.pdf?src-supplier=Avnet; ComponentLink4Description: https://datasheet.ciiva.com/8891/pyu-rc0402-51-rohs-l-6-8891339.pdf?src-supplier=Avnet; ComponentLink5URL: https://datasheet.ciiva.com/5557/pyu-rc0402-51-rohs-l-6-r-5557997.pdf?src-supplier=Mouser; ComponentLink5Description: https://datasheet.ciiva.com/5557/pyu-rc0402-51-rohs-l-6-r-5557997.pdf?src-supplier=Mouser; ComponentLink6URL: https://datasheet.ciiva.com/7983/1018594-7983533.pdf?src-supplier=Element14; ComponentLink6Description: https://datasheet.ciiva.com/7983/1018594-7983533.pdf?src-supplier=Element14; Supplier 1: Newark; Manufacturer Part Number 1: RC0402FR-1310KL; Stock 1: 62239; Pricing 1: 1=0.10000, 25=0.01200, 100=0.00400, 250=0.00400, 500=0.00300, 1000=0.00300 (USD); RoHS: Yes; Case/Package: 0402; Number of Pins: 2; Contact Plating: Tin,Matte,Lead; Case Code (Imperial): 0402; Case Code (Metric): 1005; Min Operating Temperature: -55°C; Max Operating Temperature: 155°C; Tolerance: 1%; Composition: Thick Film; Packaging: Tape and Reel; Termination: SMD/SMT; Military Standard: Not; Voltage Rating (DC): 50V; Working Voltage: 50V; Number of Terminations: 2; Length: 1mm; Depth: 0.5mm; Radiation Hardening: No; REACH SVHC: No SVHC; Lead Free: Lead Free; Supplier Part Number 1: 67R9960
R15 R17 = CRCW04021M80FKED: RES SMD 1.8M OHM 1% 1/16W 0402; Manufacturer 1: Vishay; Voltage Rating: 50V; Temperature Coefficient: 100ppm/°C; Power Rating: 63mW; Supplier 1: Digi-Key; Manufacturer Part Number 1: CRCW04021M80FKED; Stock 1: 26061; Pricing 1: 1=0.10000, 10=0.03800, 100=0.01540, 1000=0.00690, 2500=0.00599, 5000=0.00495 (USD); RoHS: Yes; Mount: Surface Mount; Case/Package: 0402; Number of Pins: 2; Weight: 2.3E-05oz; Case Code (Imperial): 0402; Case Code (Metric): 1005; Contact Plating: Tin; Min Operating Temperature: -55°C; Max Operating Temperature: 155°C; Packaging: Tape and Reel; Package Quantity: 10000; Termination: SMD/SMT; Voltage Rating (DC): 50V; Composition: Thick Film; Tolerance: 1%; Military Standard: Not; Resistance: 1.8MR; Length: 1mm; Height: 0.35mm; Width: 0.5mm; Depth: 0.5mm; Radiation Hardening: No; Lead Free: Lead Free; REACH SVHC: Unknown; ComponentLink1URL: https://datasheet.ciiva.com/11812/0900766b80d98824-11812579.pdf?src-supplier=RSComponents; ComponentLink1Description: https://datasheet.ciiva.com/11812/0900766b80d98824-11812579.pdf?src-supplier=RSComponents; ComponentLink2URL: https://datasheet.ciiva.com/16886/dcrcwe3-16886536.pdf?src-supplier=Avnet+Europe; ComponentLink2Description: https://datasheet.ciiva.com/16886/dcrcwe3-16886536.pdf?src-supplier=Avnet+Europe; ComponentLink3URL: https://datasheet.ciiva.com/7800/1697337-7800987.pdf?src-supplier=Element14; ComponentLink3Description: https://datasheet.ciiva.com/7800/1697337-7800987.pdf?src-supplier=Element14; ComponentLink4URL: https://datasheet.ciiva.com/16786/70201119-16786875.pdf?src-supplier=Allied+Electronics; ComponentLink4Description: https://datasheet.ciiva.com/16786/70201119-16786875.pdf?src-supplier=Allied+Electronics; ComponentLink5URL: https://datasheet.ciiva.com/22676/1700796-22676027.pdf?src-supplier=Element14; ComponentLink5Description: https://datasheet.ciiva.com/22676/1700796-22676027.pdf?src-supplier=Element14; ComponentLink6URL: https://datasheet.ciiva.com/7800/1697337-7800988.pdf?src-supplier=Element14; ComponentLink6Description: https://datasheet.ciiva.com/7800/1697337-7800988.pdf?src-supplier=Element14; ComponentLink7URL: https://datasheet.ciiva.com/26316/fld-crcw-e3-data-en-26316605.pdf?src-supplier=Distrelec; ComponentLink7Description: https://datasheet.ciiva.com/26316/fld-crcw-e3-data-en-26316605.pdf?src-supplier=Distrelec; ComponentLink8URL: https://datasheet.ciiva.com/8336/dcrcwe3-8336646.pdf?src-supplier=Avnet; ComponentLink8Description: https://datasheet.ciiva.com/8336/dcrcwe3-8336646.pdf?src-supplier=Avnet; Supplier Part Number 1: 541-1.80MLCT-ND
TP19 TP21-TP23 = TEST_POINT
U5 = HD3SS3212RKSR: IC MUX 2:1 8 OHM 20VQFN; Manufacturer 1: Texas Instruments; Bandwidth: 8GHz; Min Supply Voltage: 3V; Max Supply Voltage: 3.6V; Data Rate: 480Mbps; Number of Ports: 3; USB Standard: USB 3.1; Supplier 1: Digi-Key; Manufacturer Part Number 1: HD3SS3212RKSR; Stock 1: 36674; Pricing 1: 1=1.79000, 10=1.61000, 100=1.29440, 500=1.06348, 1000=0.88117 (USD); RoHS: Yes; Mount: Standard; Case/Package: VQFN; Number of Pins: 20; Min Operating Temperature: 0°C; Max Operating Temperature: 70°C; Packaging: Tape and Reel; Lead Free: Lead Free; REACH SVHC: No SVHC; ComponentLink1URL: http://www.ti.com/general/docs/lit/getliterature.tsp?genericPartNumber=HD3SS3212&&fileType=pdf&src-supplier=Avnet; ComponentLink1Description: http://www.ti.com/general/docs/lit/getliterature.tsp?genericPartNumber=HD3SS3212&&fileType=pdf&src-supplier=Avnet; ComponentLink2URL: http://www.ti.com/general/docs/lit/getliterature.tsp?genericPartNumber=HD3SS3212&amp;&amp;fileType=pdf&src-supplier=Farnell; ComponentLink2Description: http://www.ti.com/general/docs/lit/getliterature.tsp?genericPartNumber=HD3SS3212&amp;&amp;fileType=pdf&src-supplier=Farnell; ComponentLink3URL: http://www.ti.com/lit/ds/symlink/hd3ss3212.pdf?src-supplier=Digi-Key; ComponentLink3Description: http://www.ti.com/lit/ds/symlink/hd3ss3212.pdf?src-supplier=Digi-Key; ComponentLink4URL: http://www.ti.com/lit/gpn/hd3ss3212?src-supplier=Mouser; ComponentLink4Description: http://www.ti.com/lit/gpn/hd3ss3212?src-supplier=Mouser; ComponentLink5URL: http://www.ti.com/general/docs/lit/getliterature.tsp?genericPartNumber=HD3SS3212&&fileType=pdf&src-supplier=Element14; ComponentLink5Description: http://www.ti.com/general/docs/lit/getliterature.tsp?genericPartNumber=HD3SS3212&&fileType=pdf&src-supplier=Element14; Supplier Part Number 1: 296-42174-1-ND
U6 = TUSB321RWBR: IC USB PORT CONTROL TYPE-C 12X2Q; Manufacturer 1: Texas Instruments; Min Supply Voltage: 4.5V; Max Supply Voltage: 5.5V; Number of Ports: 1; USB Standard: USB 3.1; Supplier 1: Digi-Key; Manufacturer Part Number 1: TUSB321RWBR; Stock 1: 7746; Pricing 1: 1=2.27000, 10=2.04200, 100=1.64100, 500=1.34828, 1000=1.11714 (USD); RoHS: Yes; Mount: Surface Mount; Number of Pins: 12; Contact Plating: Gold; Min Operating Temperature: 0°C; Max Operating Temperature: 70°C; Packaging: Tape and Reel; REACH SVHC: No SVHC; Lead Free: Lead Free; ComponentLink1URL: http://www.ti.com/general/docs/lit/getliterature.tsp?genericPartNumber=TUSB321&&fileType=pdf&src-supplier=Avnet+Asia; ComponentLink1Description: http://www.ti.com/general/docs/lit/getliterature.tsp?genericPartNumber=TUSB321&&fileType=pdf&src-supplier=Avnet+Asia; ComponentLink2URL: http://www.ti.com/general/docs/lit/getliterature.tsp?genericPartNumber=TUSB321&&fileType=pdf&src-supplier=Farnell; ComponentLink2Description: http://www.ti.com/general/docs/lit/getliterature.tsp?genericPartNumber=TUSB321&&fileType=pdf&src-supplier=Farnell; ComponentLink3URL: http://www.ti.com/lit/ds/symlink/tusb321.pdf?src-supplier=Digi-Key; ComponentLink3Description: http://www.ti.com/lit/ds/symlink/tusb321.pdf?src-supplier=Digi-Key; ComponentLink4URL: http://www.ti.com/general/docs/lit/getliterature.tsp?genericPartNumber=TUSB321&&fileType=pdf&src-supplier=Element14; ComponentLink4Description: http://www.ti.com/general/docs/lit/getliterature.tsp?genericPartNumber=TUSB321&&fileType=pdf&src-supplier=Element14; ComponentLink5URL: http://www.ti.com/general/docs/lit/getliterature.tsp?genericPartNumber=TUSB321&&fileType=pdf&src-supplier=Avnet; ComponentLink5Description: http://www.ti.com/general/docs/lit/getliterature.tsp?genericPartNumber=TUSB321&&fileType=pdf&src-supplier=Avnet; Supplier Part Number 1: 296-42400-1-ND

## Sheet BW1098OBC_Project_Information.SchDoc: =project_title
size Tabloid; CompanyName: Luxonis Holding; DrawnBy: Brian Weinstein; Organization: Luxonis Holding; Address1: 1925 Harmony Park Drive; Address2: Westminster, CO; Address3: 80234; Address4: United States; DocumentNumber: DXXXX; Revision: R2M0E2; SheetNumber: 1; SheetTotal: 8
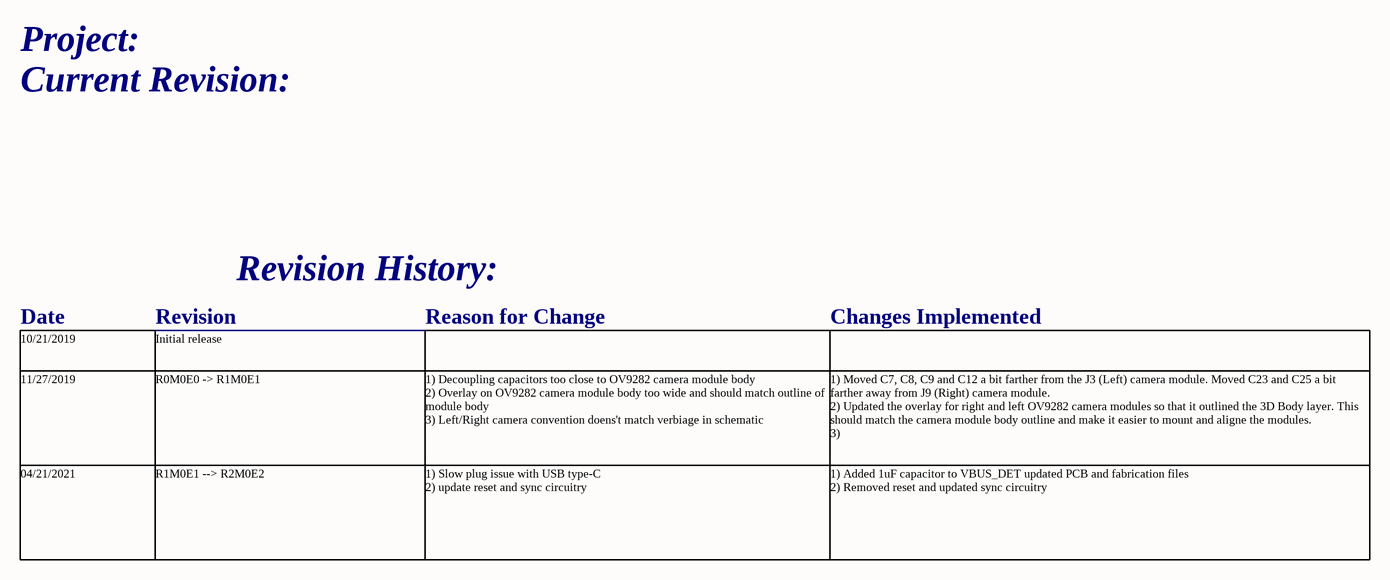
[diagram p7: BW1098OBC_Project_Information.SchDoc]

### Notes on the sheet
- Project:
- Current Revision:
- Revision History:
- 10/21/2019
- Date
- Initial release
- Revision
- Reason for Change
- Changes Implemented
- 11/27/2019
- R0M0E0 -> R1M0E1
- 1) Decoupling capacitors too close to OV9282 camera module body
  2) Overlay on OV9282 camera module body too wide and should match outline of module body
  3) Left/Right camera convention doens't match verbiage in schematic
- 1) Moved C7, C8, C9 and C12 a bit farther from the J3 (Left) camera module. Moved C23 and C25 a bit farther away from J9 (Right) camera module.
  2) Updated the overlay for right and left OV9282 camera modules so that it outlined the 3D Body layer. This should match the camera module body outline and make it easier to mount and aligne the modules.
  3)
- 04/21/2021
- R1M0E1 --> R2M0E2
- 1) Slow plug issue with USB type-C
  2) update reset and sync circuitry
- 1) Added 1uF capacitor to VBUS_DET updated PCB and fabrication files
  2) Removed reset and updated sync circuitry
- Title
- Size:
- Date:
- Tabloid
- Number:
- Time:
- Revision:
- Sheet
- of
- Drawn by:

## Nets that join several sheets
1V2: BW1098OBC_Power_Supply (C39.2 TP10.1 U8.5), BW1098OBC_RIGHT_OV9282 (FB9.1), BW1098OBC_LEFT_OV9282 (FB6.1)
1V05: BW1098OBC_Power_Supply (5 pins), BW1098OBC_IMX378 (FB3.1)
1V8: BW1098OBC_Power_Supply (C18.2 TP11.1 U2.5), BW1098OBC_IMX378 (FB2.1), BW1098OBC_RIGHT_OV9282 (FB8.1), BW1098OBC_LEFT_OV9282 (FB5.1)
2V8: BW1098OBC_Power_Supply (C20.2 TP12.1 U3.5), BW1098OBC_IMX378 (FB1.1), BW1098OBC_RIGHT_OV9282 (FB7.1), BW1098OBC_LEFT_OV9282 (FB4.1)
3V3: BW1098OBC_Power_Supply (C15.2 TP9.1 U1.1), BW1098OBC_USB (C35.2 R13.2 U5.6)
GND: BW1098OBC_TopLevel (MP5.1 MP6.1 MP7.1 MP8.1), BW1098OBC_Power_Supply (28 pins), BW1098OBC_Connector (48 pins), BW1098OBC_IMX378 (16 pins), BW1098OBC_RIGHT_OV9282 (16 pins), BW1098OBC_LEFT_OV9282 (16 pins), BW1098OBC_USB (22 pins)
VBUS: BW1098OBC_Power_Supply (R6.1 TP8.1), BW1098OBC_Connector (J1.53), BW1098OBC_USB (10 pins)
VDD_5V: BW1098OBC_Power_Supply (21 pins), BW1098OBC_Connector (12 pins), BW1098OBC_USB (C36.2 R20.2 R21.2 U6.12)
CAM_A_CLK_OUT: BW1098OBC_Connector (J1.28), BW1098OBC_IMX378 (J2.30)
CAM_A_PWDN_N: BW1098OBC_Connector (J1.34), BW1098OBC_IMX378 (J2.23 R1.1)
CAM_B_CLK_OUT: BW1098OBC_Connector (J1.73), BW1098OBC_RIGHT_OV9282 (J9.24), BW1098OBC_LEFT_OV9282 (J3.24)
CAM_B_D_PWM: BW1098OBC_Connector (J1.65), BW1098OBC_RIGHT_OV9282 (J9.22 R9.1)
CAM_B_PWDN_N: BW1098OBC_Connector (J1.67), BW1098OBC_LEFT_OV9282 (J3.22 R2.1)
COM_AUX_IO2: BW1098OBC_Connector (J1.42 TP4.1), BW1098OBC_LEFT_OV9282 (R4.1)
FSIN2: BW1098OBC_RIGHT_OV9282 (R10.2), BW1098OBC_LEFT_OV9282 (R26.2)
I2C1_SCL: BW1098OBC_Connector (J1.35), BW1098OBC_IMX378 (J2.20)
I2C1_SDA: BW1098OBC_Connector (J1.33), BW1098OBC_IMX378 (J2.19)
I2C2_SCL: BW1098OBC_Connector (J1.77), BW1098OBC_RIGHT_OV9282 (J9.21), BW1098OBC_LEFT_OV9282 (J3.21)
I2C2_SDA: BW1098OBC_Connector (J1.79), BW1098OBC_RIGHT_OV9282 (J9.20), BW1098OBC_LEFT_OV9282 (J3.20)
MIPI_RX2_C_N: BW1098OBC_Connector (J1.95), BW1098OBC_LEFT_OV9282 (J3.11)
MIPI_RX2_C_P: BW1098OBC_Connector (J1.97), BW1098OBC_LEFT_OV9282 (J3.10)
MIPI_RX2_D0_N: BW1098OBC_Connector (J1.89), BW1098OBC_LEFT_OV9282 (J3.8)
MIPI_RX2_D0_P: BW1098OBC_Connector (J1.91), BW1098OBC_LEFT_OV9282 (J3.7)
MIPI_RX2_D1_N: BW1098OBC_Connector (J1.83), BW1098OBC_LEFT_OV9282 (J3.5)
MIPI_RX2_D1_P: BW1098OBC_Connector (J1.85), BW1098OBC_LEFT_OV9282 (J3.4)
MIPI_RX3_C_N: BW1098OBC_Connector (J1.96), BW1098OBC_RIGHT_OV9282 (J9.11)
MIPI_RX3_C_P: BW1098OBC_Connector (J1.98), BW1098OBC_RIGHT_OV9282 (J9.10)
MIPI_RX3_D0_N: BW1098OBC_Connector (J1.90), BW1098OBC_RIGHT_OV9282 (J9.8)
MIPI_RX3_D0_P: BW1098OBC_Connector (J1.92), BW1098OBC_RIGHT_OV9282 (J9.7)
MIPI_RX3_D1_N: BW1098OBC_Connector (J1.84), BW1098OBC_RIGHT_OV9282 (J9.5)
MIPI_RX3_D1_P: BW1098OBC_Connector (J1.86), BW1098OBC_RIGHT_OV9282 (J9.4)
MIPI_RX4_C_N: BW1098OBC_Connector (J1.3), BW1098OBC_IMX378 (J2.28)
MIPI_RX4_C_P: BW1098OBC_Connector (J1.5), BW1098OBC_IMX378 (J2.27)
MIPI_RX4_D0_N: BW1098OBC_Connector (J1.9), BW1098OBC_IMX378 (J2.5)
MIPI_RX4_D0_P: BW1098OBC_Connector (J1.11), BW1098OBC_IMX378 (J2.6)
MIPI_RX4_D1_N: BW1098OBC_Connector (J1.15), BW1098OBC_IMX378 (J2.26)
MIPI_RX4_D1_P: BW1098OBC_Connector (J1.17), BW1098OBC_IMX378 (J2.25)
MIPI_RX5_D0_N: BW1098OBC_Connector (J1.21), BW1098OBC_IMX378 (J2.8)
MIPI_RX5_D0_P: BW1098OBC_Connector (J1.23), BW1098OBC_IMX378 (J2.9)
MIPI_RX5_D1_N: BW1098OBC_Connector (J1.27), BW1098OBC_IMX378 (J2.2)
MIPI_RX5_D1_P: BW1098OBC_Connector (J1.29), BW1098OBC_IMX378 (J2.3)
USB_D_N: BW1098OBC_Connector (J1.18), BW1098OBC_USB (J10.A7 J10.B7)
USB_D_P: BW1098OBC_Connector (J1.16), BW1098OBC_USB (J10.A6 J10.B6)
USB_RX_N: BW1098OBC_Connector (J1.12), BW1098OBC_USB (U5.4)
USB_RX_P: BW1098OBC_Connector (J1.10), BW1098OBC_USB (U5.3)
USB_TX_N: BW1098OBC_Connector (J1.24), BW1098OBC_USB (U5.8)
USB_TX_P: BW1098OBC_Connector (J1.22), BW1098OBC_USB (U5.7)

## Assembly variants
Production: not fitted J4 J5 J6 MISC1 R6 R18 R19